# EAGLE design FeatherAB1805-SC (EAGLE 9.6.2)
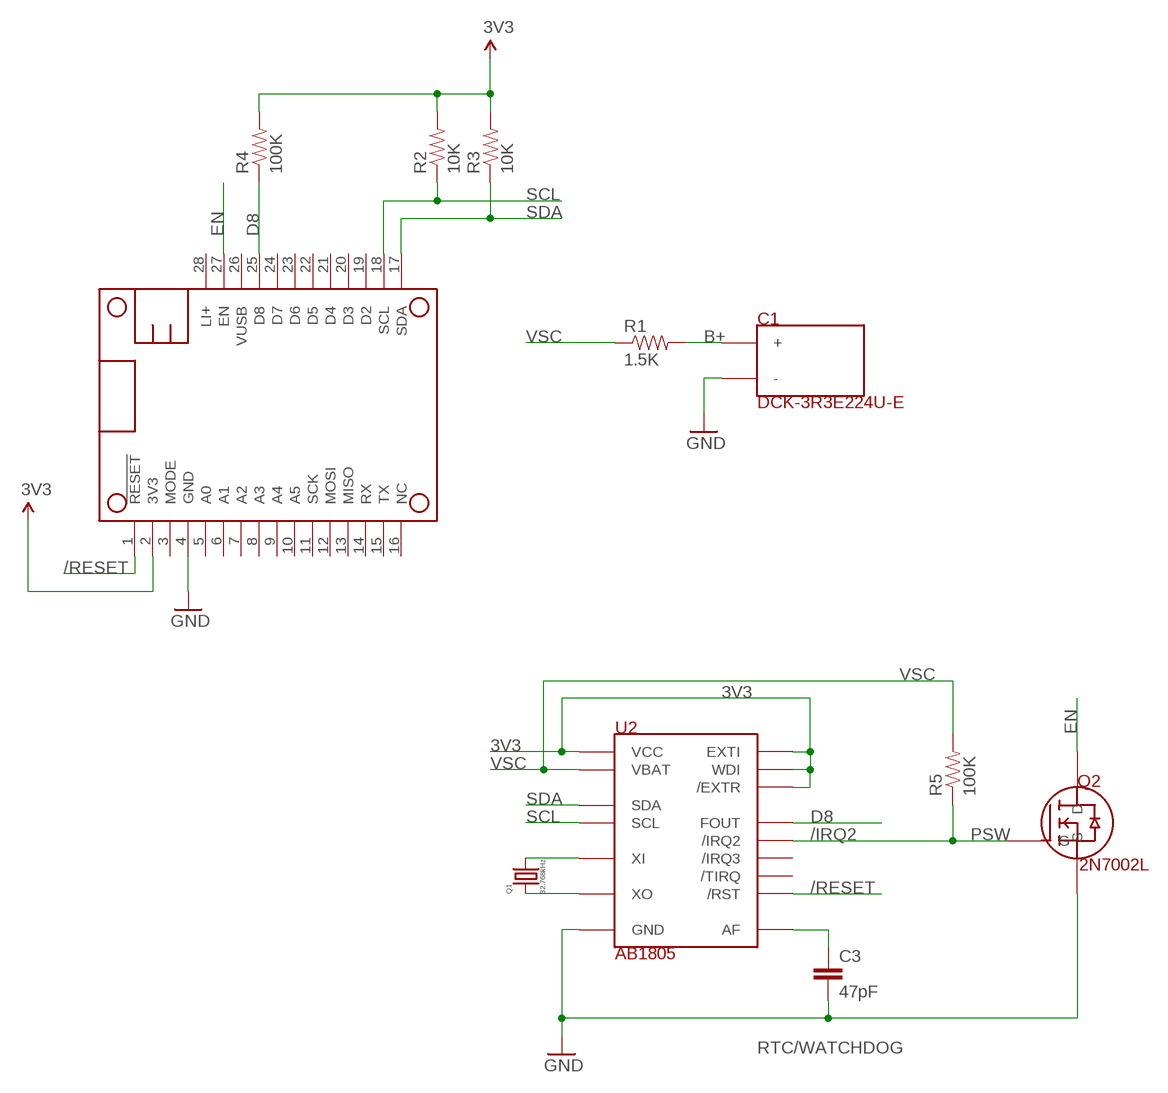
[diagram p0: schematic, sheet 1]

## Parts
C1  DCK-3R3E224U-E  SUPERCAP-DCK-3R3E224U-E  [SUPERCAP-DCK-3R3E224U-E]
C3  47pF  CAP-47PF-0603  [0603-CAP]
MS1  FEATHERWING_NODIM  [FEATHERWING_NODIM]
Q1  32.768kHz  ABS07-120-32.768KHZ  [ABS07-120-CRYSTAL]
Q2  2N7002L  [2N7002L]
R1  1.5K  RES-1.5K-0603  [0603-RES]
R2  10K  RES-10K-06030603  [0603-RES]
R3  10K  RES-10K-06030603  [0603-RES]
R4  100K  RES-100K-0603  [0603-RES]
R5  100K  RES-100K-0603  [0603-RES]
U2  AB1805  [16-VFQFN-ABRACON]

## Nets
3V3: MS1.2(3V3) R2.2 R3.2 R4.2 U2.2(WDI) U2.3(/EXTR) U2.10(EXTI) U2.13(VCC)
/IRQ2: Q2.1(G) R5.1 U2.4(/IRQ2)
/RESET: MS1.1(!RESET) U2.1(/RST)
AF: C3.1 U2.14(AF)
B+: C1.+ R1.2
D8: MS1.25(D8) R4.1 U2.11(FOUT)
EN: MS1.27(EN) Q2.3(D)
GND: C1.- C3.2 MS1.4(GND) Q2.2(S) U2.9(GND) U2.EP(GND)
SCL: MS1.18(SCL) R2.1 U2.7(SCL)
SDA: MS1.17(SDA) R3.1 U2.6(SDA)
VSC: R1.1 R5.2 U2.5(VBAT)
XI: Q1.2 U2.16(XI)
XO: Q1.1 U2.15(XO)
Unconnected: MS1.3(MODE) MS1.5(A0) MS1.6(A1) MS1.7(A2) MS1.8(A3) MS1.9(A4) MS1.10(A5) MS1.11(SCK) MS1.12(MOSI) MS1.13(MISO) MS1.14(RX) MS1.15(TX) MS1.16(NC) MS1.19(D2) MS1.20(D3) MS1.21(D4) MS1.22(D5) MS1.23(D6) MS1.24(D7) MS1.26(VUSB) MS1.28(LI+) U2.8(/IRQ3) U2.12(/TIRQ)

## Notes on the sheet
- PSW
- RTC/WATCHDOG

## Library data of the parts
C1 = rickk2:SUPERCAP-DCK-3R3E224U-E: Elna America DCK-3R3E224U-E $1.41 CAP 220MF -20% +80% 3.3V SMD 220mF (EDLC) Supercapacitor 3.3V Coin, Wide Terminals - Same Sides 200Ohm @ 1kHz 1000 Hrs @ 60°C https://www.digikey.com/product-detail/en/elna-america/DCK-3R3E224U-E/604-1007-ND/970168
C3 = rickk2:CAP-47PF-0603: CAP CER 47PF 100V C0G/NP0 0603 Murata Electronics GCM1885C2A470FA16D $0.22 47pF ±1% 100V Ceramic Capacitor C0G, NP0 0603 (1608 Metric) https://www.digikey.com/product-detail/en/murata-electronics/GCM1885C2A470FA16D/490-16408-1-ND/7363390 - Not ordered yet!
MS1 = Particle-Mesh:FEATHERWING
Q1 = rickk2:ABS07-120-32.768KHZ: CRYSTAL 32.7680KHZ 6PF SMD Abracon LLC ABS07-120-32.768KHZ-T $0.77 32.768kHz ±20ppm Crystal 6pF 55 kOhms 2-SMD, No Lead https://www.digikey.com/product-detail/en/abracon-llc/ABS07-120-32-768KHZ-T/535-11937-1-ND/3724046 - Not ordered yet
Q2 = rickk2:2N7002L: MOSFET N-CH 60V 0.115A SOT-23 $ 0.16 On Semicondutor 2N7002LT1G N-Channel 115mA (Tc) 225mW (Ta) Surface Mount SOT-23-3 (TO-236) https://www.digikey.com/product-detail/en/on-semiconductor/2N7002LT3G/2N7002LT3GOSCT-ND/2704932 1=G, high=D is connected to S (GND), the "on" state 2=S to GND (bottom of symbol) 3=D to load (top of symbol, pin on the side by itself) 2A version: Diodes Inc DMN6075S-7 MOSFET N-CH 60V 2A SOT23-3 $0.45 https://www.digikey.com/product-detail/en/diodes-incorporated/DMN6075S-7/DMN6075S-7DICT-ND/5149299 Old: https://www.digikey.com/product-detail/en/on-semiconductor/2N7002LT1G/2N7002LT1GOSCT-ND/917791
R1 = rickk2:RES-1.5K-0603: RES SMD 1.5K OHM 1% 1/10W 0603 $0.10 https://www.digikey.com/product-detail/en/panasonic-electronic-components/ERJ-3EKF1501V/P1.50KHCT-ND/198088
R2 R3 = rickk2:RES-10K-0603: RES SMD 10K OHM 5% 1/4W 0603 $ 0.10 https://www.digikey.com/product-detail/en/panasonic-electronic-components/ERJ-PA3J103V/P10KBZCT-ND/5036237
R4 R5 = rickk2:RES-100K-0603: 100 kOhms ±1% 0.1W, 1/10W Chip Resistor 0603 (1608 Metric) Automotive AEC-Q200 Thick Film https://www.digikey.com/product-detail/en/panasonic-electronic-components/ERJ-3EKF1003V/P100KHCT-ND/198110 Old: RES SMD 100K OHM 1% 1/4W 0603 $ 0.16 Panasonic ERJ-PA3F1003V ±1% 0.25W, 1/4W Chip Resistor 0603 (1608 Metric) Automotive AEC-Q200, Pulse Withstanding Thick Film https://www.digikey.com/product-detail/en/panasonic-electronic-components/ERJ-PA3F1003V/P100KBYCT-ND/5036116
U2 = rickk2:AB1805: Abracon LLC AB1805-T3 $1.79 IC RTC CLK/CALENDAR I2C 16-QFN Real Time Clock (RTC) IC Clock/Calendar 256B I²C, 2-Wire Serial 16-VFQFN Exposed Pad https://www.digikey.com/product-detail/en/abracon-llc/AB1805-T3/535-11932-1-ND/3661512

## Board
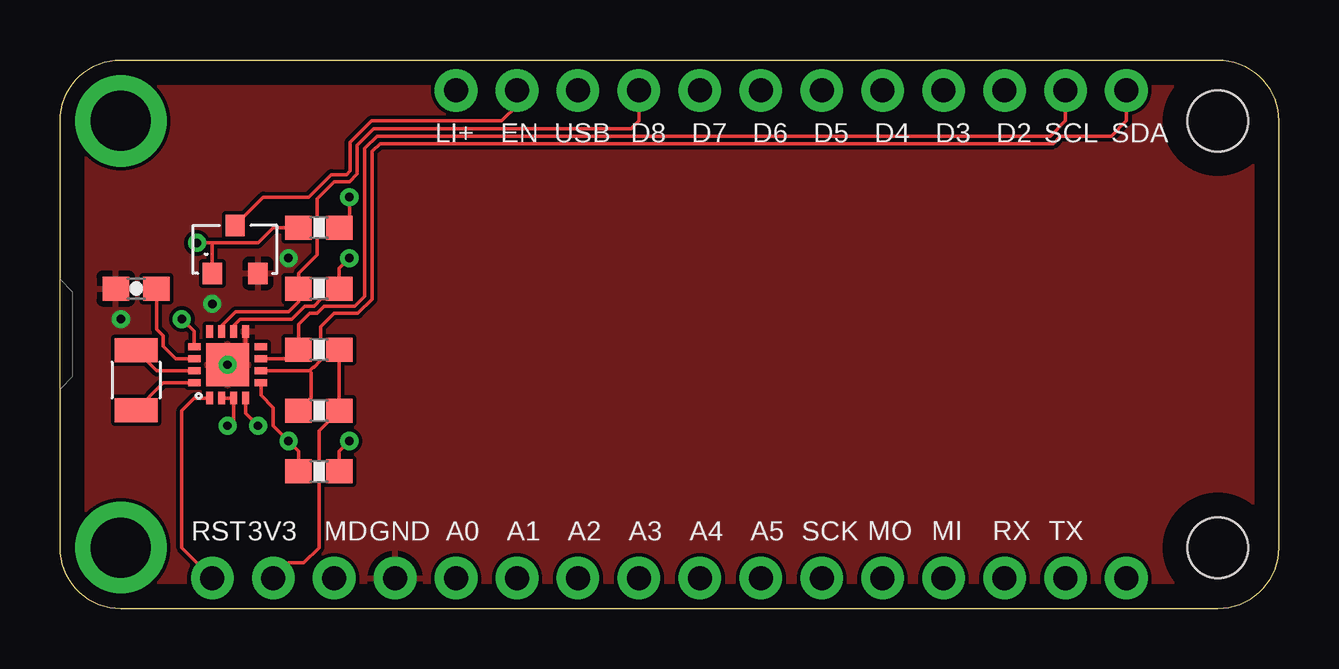
[diagram p1: board, top side]
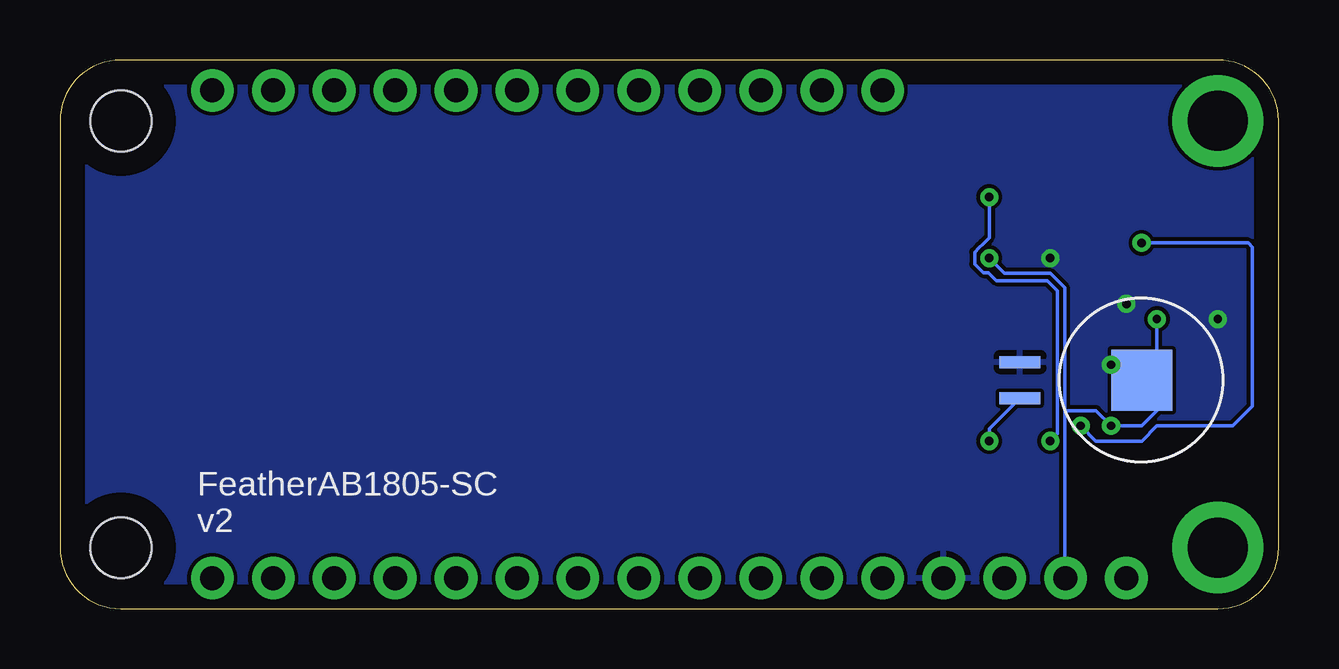
[diagram p2: board, bottom side, seen from below]

Size 50.8 x 22.86 mm. Coordinates in mm from the lower left corner, seen from the top.
Outline: 2.54,22.86 48.26,22.86 arc-90 50.8,20.32 50.8,2.54 arc-90 48.26,0 2.54,0 arc-90 0,2.54 0,20.32 arc-90 2.54,22.86
Copper layers (1*16): Top 0.035mm / dielectric 1.5mm / Bottom 0.035mm
Design rules "default": minimum track width 6mil, minimum drill 0.35mm, track to track 6mil, track to pad 6mil, pad to pad 6mil, via to via 6mil, smd to smd 6mil, copper to edge 40mil, drill to drill 6mil, minimum pad ring 10mil, minimum via ring 8mil, stop-mask expansion 4mil, vias tented up to drill 0mil, thermal gap 10mil

### Footprints (pad centres in the part's own frame; a part is rotated, then mirrored left to right if it is on the bottom)
SUPERCAP-DCK-3R3E224U-E = smd 0.5 x 1.7: + 0.75,-3.8; - -0.75,-3.8 | smd 2.54 x 2.54: G 0,1.27
0603-CAP = smd 1.1 x 1: 1 -0.85,0; 2 0.85,0
FEATHERWING_NODIM = drill 1 pad 1.778: 1 6.35,1.27; 2 8.89,1.27; 3 11.43,1.27; 4 13.97,1.27; 5 16.51,1.27; 6 19.05,1.27; 7 21.59,1.27; 8 24.13,1.27; 9 26.67,1.27; 10 29.21,1.27; 11 31.75,1.27; 12 34.29,1.27; 13 36.83,1.27; 14 39.37,1.27; 15 41.91,1.27; 16 44.45,1.27; 17 44.45,21.59; 18 41.91,21.59; 19 39.37,21.59; 20 36.83,21.59; 21 34.29,21.59; 22 31.75,21.59; 23 29.21,21.59; 24 26.67,21.59; 25 24.13,21.59; 26 21.59,21.59; 27 19.05,21.59; 28 16.51,21.59 | drill 2.5 pad 3.81: P$1 2.54,20.32; P$2 2.54,2.54 | hole 2.54: 48.26,20.32; 48.26,2.54
ABS07-120-CRYSTAL = smd 1 x 1.8: 1 -1.25,0; 2 1.25,0
2N7002L = smd 0.8 x 0.9: 1 0,0; 2 1.9,0; 3 0.95,2
0603-RES = smd 1.1 x 1: 1 -0.85,0; 2 0.85,0
16-VFQFN-ABRACON = smd 0.3 x 0.52: 1 -0.75,-1.39; 2 -0.25,-1.39; 3 0.25,-1.39; 4 0.75,-1.39; 9 0.75,1.39; 10 0.25,1.39; 11 -0.25,1.39; 12 -0.75,1.39 | smd 0.52 x 0.3: 5 1.39,-0.75; 6 1.39,-0.25; 7 1.39,0.25; 8 1.39,0.75; 13 -1.39,0.75; 14 -1.39,0.25; 15 -1.39,-0.25; 16 -1.39,-0.75 | smd 1.8 x 1.8: EP 0,0

### Placement (x,y rotation side)
C1  6.99,9.53 270 bottom
C3  3.17,13.34 180 top
MS1  0,0 0 top
Q1  3.17,9.53 270 top
Q2  6.35,13.97 0 top
R1  10.79,5.71 0 top
R2  10.79,10.79 0 top
R3  10.79,8.26 0 top
R4  10.79,13.34 0 top
R5  10.79,15.88 0 top
U2  6.99,10.16 0 top

### Tracks (layer width: path | path; a pad name or v marks a point on that pad's centre or on a via)
3V3  (via drill 0.35)
  Top 0.152: R2.2 R3.2 10.79,7.41 10.79,2.54 10.16,1.91 9.53,1.91 MS1.2 | v12.06,14.61 11.64,14.19 R4.2 11.22,12.91 10.89,12.91 10.59,12.61 10.19,12.61 9.65,12.06 7.52,12.06 7.24,11.78 U2.10 | U2.2 U2.3 7.24,7.87 v6.99,7.62 | v5.08,12.06 5.59,11.55 U2.13
  Bottom 0.152: MS1.2 8.92,1.3 8.92,8.26 | v5.08,12.06 5.08,8.26 5.71,7.62 v6.99,7.62 7.62,8.26 8.92,8.26 | v12.06,14.61 11.43,13.97 9.53,13.97 8.92,13.36 8.92,8.26
/IRQ2  (via drill 0.35)
  Top 0.152: U2.4 7.74,8.14 v8.26,7.62 | R5.1 8.89,15.88 8.26,15.24 6.35,15.24 | v5.71,15.24 6.35,15.24 | Q2.1 6.35,15.24
  Bottom 0.152: v8.26,7.62 7.62,6.99 5.71,6.99 5.08,7.62 1.91,7.62 1.09,8.43 1.09,15.06 1.27,15.24 v5.71,15.24
/RESET
  Top 0.152: MS1.1 5.08,2.54 5.08,8.26 5.59,8.77 U2.1
AF
  Top 0.152: U2.14 4.83,10.41 4.3,10.94 4.3,11.37 4.03,11.65 C3.1
B+  (via drill 0.35)
  Top 0.152: R1.2 11.64,6.57 v12.06,6.99
  Bottom 0.152: C1.+ 12.06,7.5 v12.06,6.99
D8
  Top 0.152: U2.11 6.74,11.78 7.32,12.37 9.53,12.37 9.95,12.79 R4.1 9.95,13.97 10.72,14.74 10.72,17.07 11.43,17.78 12.06,17.78 12.39,18.11 12.39,19.3 13.08,19.99 13.34,19.99 23.8,19.99 24.13,20.32 MS1.25
EN
  Top 0.152: MS1.27 19.05,20.95 18.41,20.32 12.98,20.32 12.09,19.43 12.09,19.05 12.09,18.24 11.94,18.09 11.3,18.09 10.36,17.14 8.47,17.14 Q2.3
GND  (via drill 0.35)
  Top 0.152: U2.9 7.74,10.91 U2.EP
  other vias: 6.99,10.16 2.54,12.06 9.53,14.61 6.35,12.7
  pour Top: 0,0 0,25.4 53.34,25.4 53.34,0
  pour Bottom: 0,0 0,27.94 50.8,27.94 50.8,0
SCL
  Top 0.152: U2.7 9.56,10.41 R2.1 9.95,11.85 10.4,12.3 10.72,12.3 11.02,12.61 12.29,12.61 12.7,13.02 12.7,19.18 13.21,19.68 13.34,19.68 41.27,19.68 41.91,20.32 MS1.18
SDA
  Top 0.152: MS1.17 44.45,20.32 43.81,19.68 41.71,19.68 41.4,19.38 13.34,19.38 13.01,19.05 13.01,17.91 13.01,17.78 13.01,12.89 12.42,12.3 11.43,12.3 10.87,11.74 10.87,10.34 10.59,10.07 10.55,10.07 10.4,9.91 | U2.6 10.4,9.91 | 10.4,9.91 10.47,9.84 10.47,8.78 R3.1
VSC  (via drill 0.35)
  Top 0.152: U2.5 8.38,8.89 8.89,8.38 8.89,7.62 v9.53,6.99 9.95,6.57 R1.1 | v12.06,17.14 12.06,16.3 R5.2
  Bottom 0.152: v9.53,6.99 9.22,7.29 9.22,13.24 9.65,13.66 11.76,13.66 12.09,14 12.32,14 12.67,14.35 12.67,14.86 12.49,15.03 12.32,15.21 12.06,15.46 v12.06,17.14
XI
  Top 0.152: Q1.2 4.31,9.41 U2.16
XO
  Top 0.152: U2.15 4.04,9.91 Q1.1

### Text on the board
tPlace: LI+ | EN | USB | D8 | D7 | D6 | D5 | D4 | D3 | D2 | SCL | SDA | RST | 3V3 | MD | GND | A0 | A1 | A2 | A3 | A4 | A5 | SCK | MO | MI | RX | TX
bPlace: FeatherAB1805-SC / v2